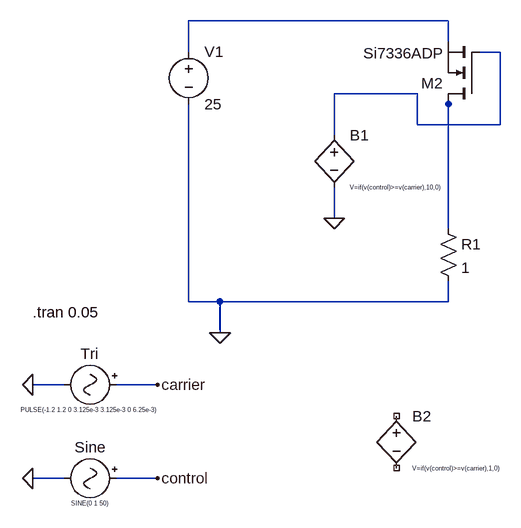
[diagram p0: schematic Transistors.asc]
Transistors.asc, the LTspice schematic file:
Version 4
SHEET 1 1556 680
WIRE 608 -304 208 -304
WIRE 608 -272 608 -304
WIRE 208 -256 208 -304
WIRE 688 -256 656 -256
WIRE 560 -192 432 -192
WIRE 608 -176 608 -192
WIRE 560 -144 560 -192
WIRE 688 -144 688 -256
WIRE 688 -144 560 -144
WIRE 432 -128 432 -192
WIRE 432 0 432 -48
WIRE 608 16 608 -176
WIRE 208 128 208 -176
WIRE 256 128 208 128
WIRE 608 128 608 96
WIRE 608 128 256 128
WIRE 256 176 256 128
WIRE 16 256 -32 256
WIRE 160 256 96 256
WIRE 16 400 -32 400
WIRE 160 400 96 400
FLAG -32 256 0
FLAG -32 400 0
FLAG 160 256 carrier
FLAG 160 400 control
FLAG 256 176 0
FLAG 432 0 0
SYMBOL signal 112 256 R90
WINDOW 0 -32 56 VBottom 2
WINDOW 3 32 56 VTop 0
SYMATTR InstName Tri
SYMATTR Value PULSE(-1.2 1.2 0 3.125e-3 3.125e-3 0 6.25e-3)
SYMBOL signal 112 400 R90
WINDOW 0 -32 56 VBottom 2
WINDOW 3 32 56 VTop 0
SYMATTR InstName Sine
SYMATTR Value SINE(0 1 50)
SYMBOL bv 432 -144 R0
WINDOW 3 24 96 Left 0
SYMATTR Value V=if(v(control)>=v(carrier),10,0)
SYMATTR InstName B1
SYMBOL Res 592 0 R0
SYMATTR InstName R1
SYMATTR Value 1
SYMBOL voltage 208 -272 R0
SYMATTR InstName V1
SYMATTR Value 25
SYMBOL bv 528 288 R0
WINDOW 3 24 96 Left 0
SYMATTR Value V=if(v(control)>=v(carrier),1,0)
SYMATTR InstName B2
SYMBOL nmos 656 -176 R180
WINDOW 3 55 78 Left 2
SYMATTR InstName M2
SYMATTR Value Si7336ADP
TEXT -32 144 Left 2 !.tran 0.05

The netlist it stands for:
* Transistors.asc
V§Tri carrier 0 PULSE(-1.2 1.2 0 3.125e-3 3.125e-3 0 6.25e-3)
V§Sine control 0 SINE(0 1 50)
B1 N002 0 V=if(v(control)>=v(carrier),10,0)
R1 N003 0 1
V1 N001 0 25
B2 NC_01 NC_02 V=if(v(control)>=v(carrier),1,0)
M2 N003 N002 N001 N001 Si7336ADP
.model NMOS NMOS
.model PMOS PMOS
.lib standard.mos
.tran 0.05
.backanno
.end